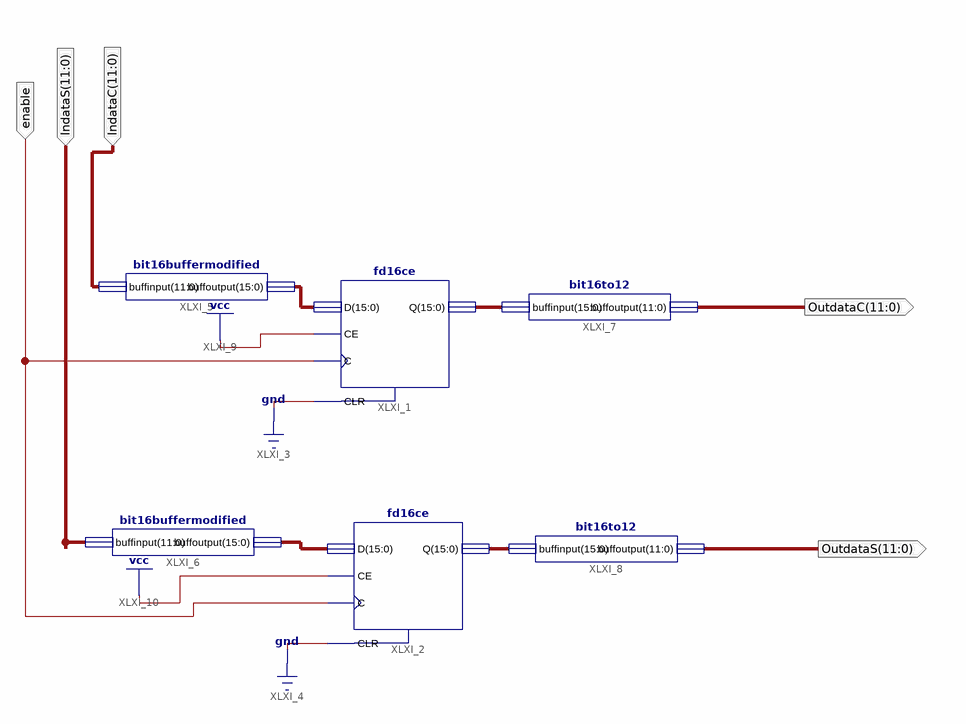
[diagram p0: schematic sheet 1]
// Xilinx ISE schematic output_enable.sch (spartan3) as structural Verilog: 6 symbols, 5 ports
module output_enable (
  input  enable,
  input  [11:0] IndataS,
  input  [11:0] IndataC,
  output [11:0] OutdataC,
  output [11:0] OutdataS
);

  wire [15:0] XLXN_8, XLXN_9, XLXN_10, XLXN_11;

  fd16ce XLXI_1 (.C(enable), .CE(1'b1), .CLR(1'b0), .D(XLXN_8), .Q(XLXN_10));
  fd16ce XLXI_2 (.C(enable), .CE(1'b1), .CLR(1'b0), .D(XLXN_9), .Q(XLXN_11));
  bit16buffermodified XLXI_5 (.buffinput(IndataC), .buffoutput(XLXN_8));
  bit16buffermodified XLXI_6 (.buffinput(IndataS), .buffoutput(XLXN_9));
  bit16to12 XLXI_7 (.buffinput(XLXN_10), .buffoutput(OutdataC));
  bit16to12 XLXI_8 (.buffinput(XLXN_11), .buffoutput(OutdataS));
endmodule
